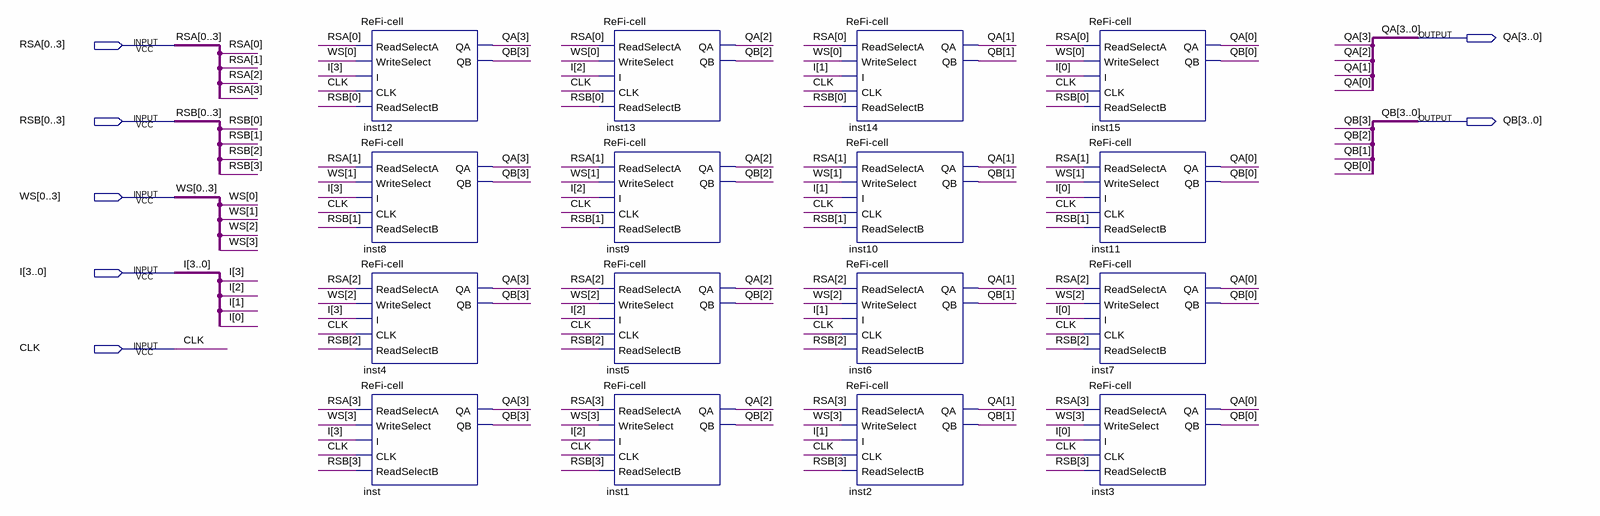
[diagram p0: schematic sheet]
// Quartus schematic Re4x4.bdf as structural Verilog: 16 symbols, 7 pins
module Re4x4 (
  input  [0:3] RSA,
  input  [0:3] RSB,
  input  [0:3] WS,
  input  [3:0] I,
  input  CLK,
  output [3:0] QA,
  output [3:0] QB
);

  \ReFi-cell  inst12 (
    .ReadSelectA(RSA[0]), .WriteSelect(WS[0]), .I(I[3]), .CLK(CLK), .ReadSelectB(RSB[0]), .QA(QA[3]),
    .QB(QB[3]));
  \ReFi-cell  inst8 (
    .ReadSelectA(RSA[1]), .WriteSelect(WS[1]), .I(I[3]), .CLK(CLK), .ReadSelectB(RSB[1]), .QA(QA[3]),
    .QB(QB[3]));
  \ReFi-cell  inst4 (
    .ReadSelectA(RSA[2]), .WriteSelect(WS[2]), .I(I[3]), .CLK(CLK), .ReadSelectB(RSB[2]), .QA(QA[3]),
    .QB(QB[3]));
  \ReFi-cell  inst (
    .ReadSelectA(RSA[3]), .WriteSelect(WS[3]), .I(I[3]), .CLK(CLK), .ReadSelectB(RSB[3]), .QA(QA[3]),
    .QB(QB[3]));
  \ReFi-cell  inst13 (
    .ReadSelectA(RSA[0]), .WriteSelect(WS[0]), .I(I[2]), .CLK(CLK), .ReadSelectB(RSB[0]), .QA(QA[2]),
    .QB(QB[2]));
  \ReFi-cell  inst9 (
    .ReadSelectA(RSA[1]), .WriteSelect(WS[1]), .I(I[2]), .CLK(CLK), .ReadSelectB(RSB[1]), .QA(QA[2]),
    .QB(QB[2]));
  \ReFi-cell  inst5 (
    .ReadSelectA(RSA[2]), .WriteSelect(WS[2]), .I(I[2]), .CLK(CLK), .ReadSelectB(RSB[2]), .QA(QA[2]),
    .QB(QB[2]));
  \ReFi-cell  inst1 (
    .ReadSelectA(RSA[3]), .WriteSelect(WS[3]), .I(I[2]), .CLK(CLK), .ReadSelectB(RSB[3]), .QA(QA[2]),
    .QB(QB[2]));
  \ReFi-cell  inst14 (
    .ReadSelectA(RSA[0]), .WriteSelect(WS[0]), .I(I[1]), .CLK(CLK), .ReadSelectB(RSB[0]), .QA(QA[1]),
    .QB(QB[1]));
  \ReFi-cell  inst10 (
    .ReadSelectA(RSA[1]), .WriteSelect(WS[1]), .I(I[1]), .CLK(CLK), .ReadSelectB(RSB[1]), .QA(QA[1]),
    .QB(QB[1]));
  \ReFi-cell  inst6 (
    .ReadSelectA(RSA[2]), .WriteSelect(WS[2]), .I(I[1]), .CLK(CLK), .ReadSelectB(RSB[2]), .QA(QA[1]),
    .QB(QB[1]));
  \ReFi-cell  inst2 (
    .ReadSelectA(RSA[3]), .WriteSelect(WS[3]), .I(I[1]), .CLK(CLK), .ReadSelectB(RSB[3]), .QA(QA[1]),
    .QB(QB[1]));
  \ReFi-cell  inst15 (
    .ReadSelectA(RSA[0]), .WriteSelect(WS[0]), .I(I[0]), .CLK(CLK), .ReadSelectB(RSB[0]), .QA(QA[0]),
    .QB(QB[0]));
  \ReFi-cell  inst11 (
    .ReadSelectA(RSA[1]), .WriteSelect(WS[1]), .I(I[0]), .CLK(CLK), .ReadSelectB(RSB[1]), .QA(QA[0]),
    .QB(QB[0]));
  \ReFi-cell  inst7 (
    .ReadSelectA(RSA[2]), .WriteSelect(WS[2]), .I(I[0]), .CLK(CLK), .ReadSelectB(RSB[2]), .QA(QA[0]),
    .QB(QB[0]));
  \ReFi-cell  inst3 (
    .ReadSelectA(RSA[3]), .WriteSelect(WS[3]), .I(I[0]), .CLK(CLK), .ReadSelectB(RSB[3]), .QA(QA[0]),
    .QB(QB[0]));
endmodule
